# EasyEDA schematic SCH_tactile patches V5_2022-08-01.json

## Sheets
1 main copy copy copy: TITLE: main; REV: 5.0; Date: 2021-10-20; Sheet: 1/3; Drawn By: zjkharry & kmyao; Company: City University of Hong Kong
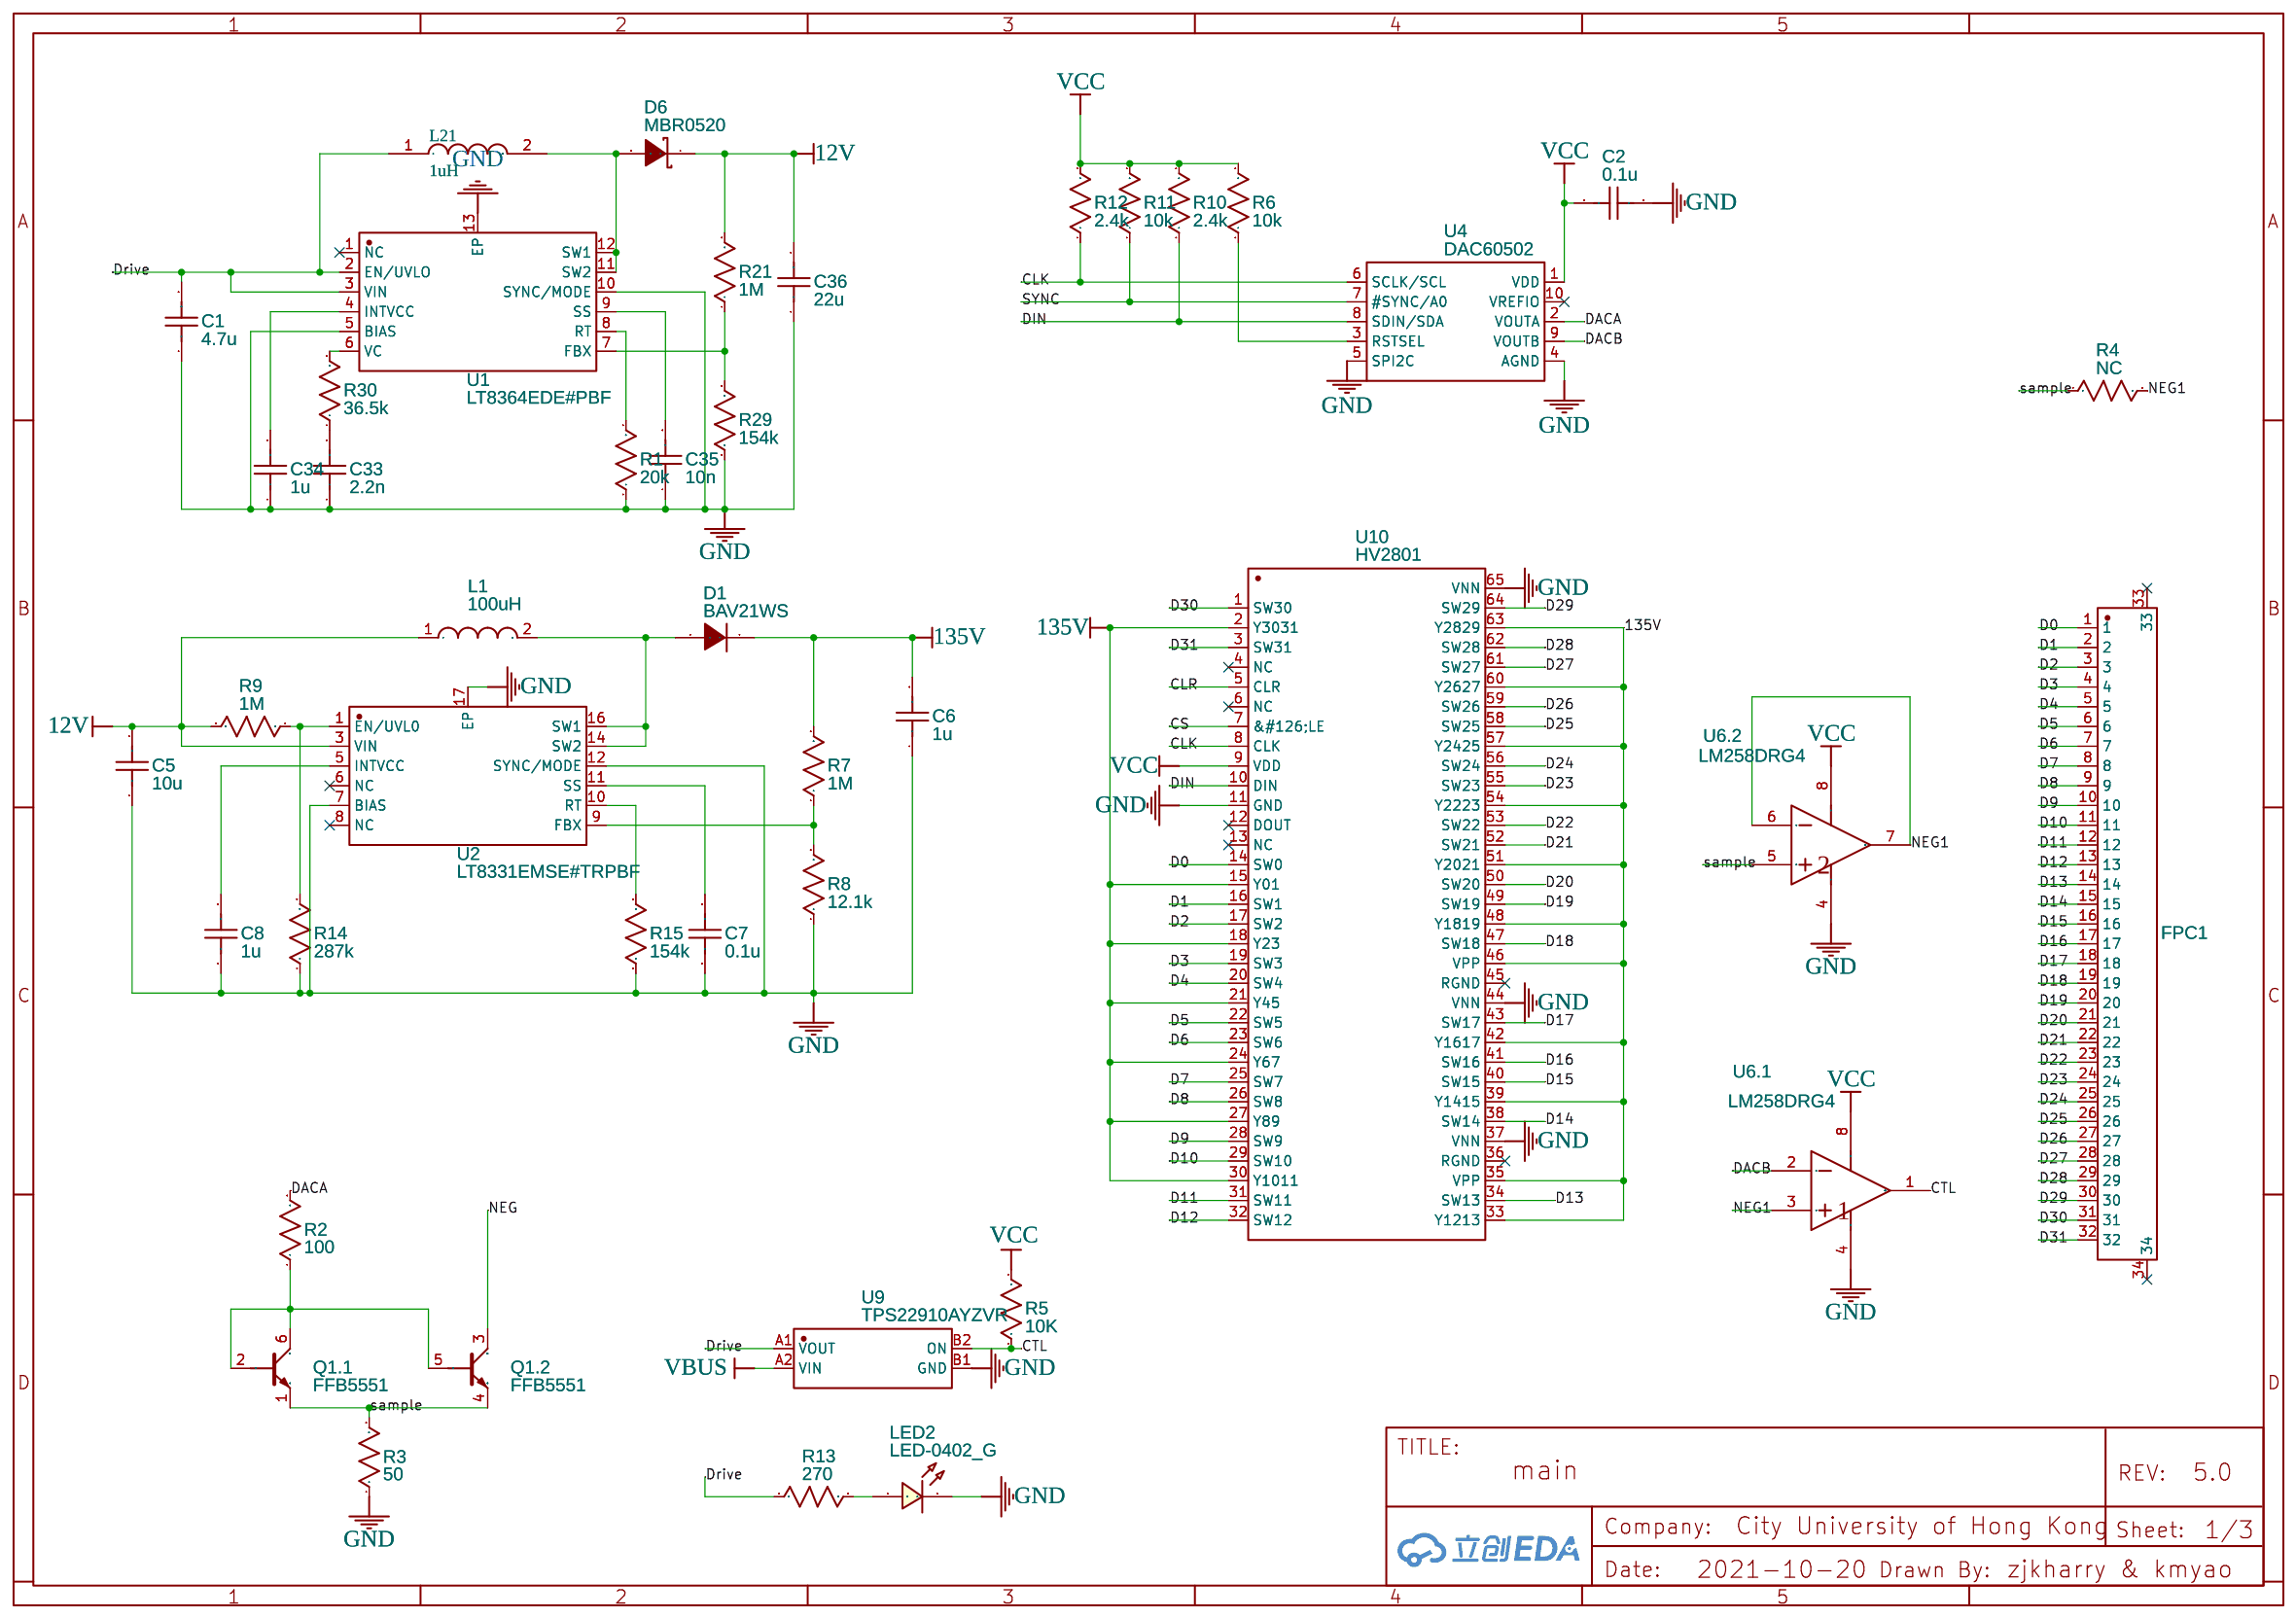
[diagram p0: main copy copy copy]
2 MCU copy copy copy: TITLE: MCU; REV: 1.0; Date: 2021-04-09; Sheet: 2/3
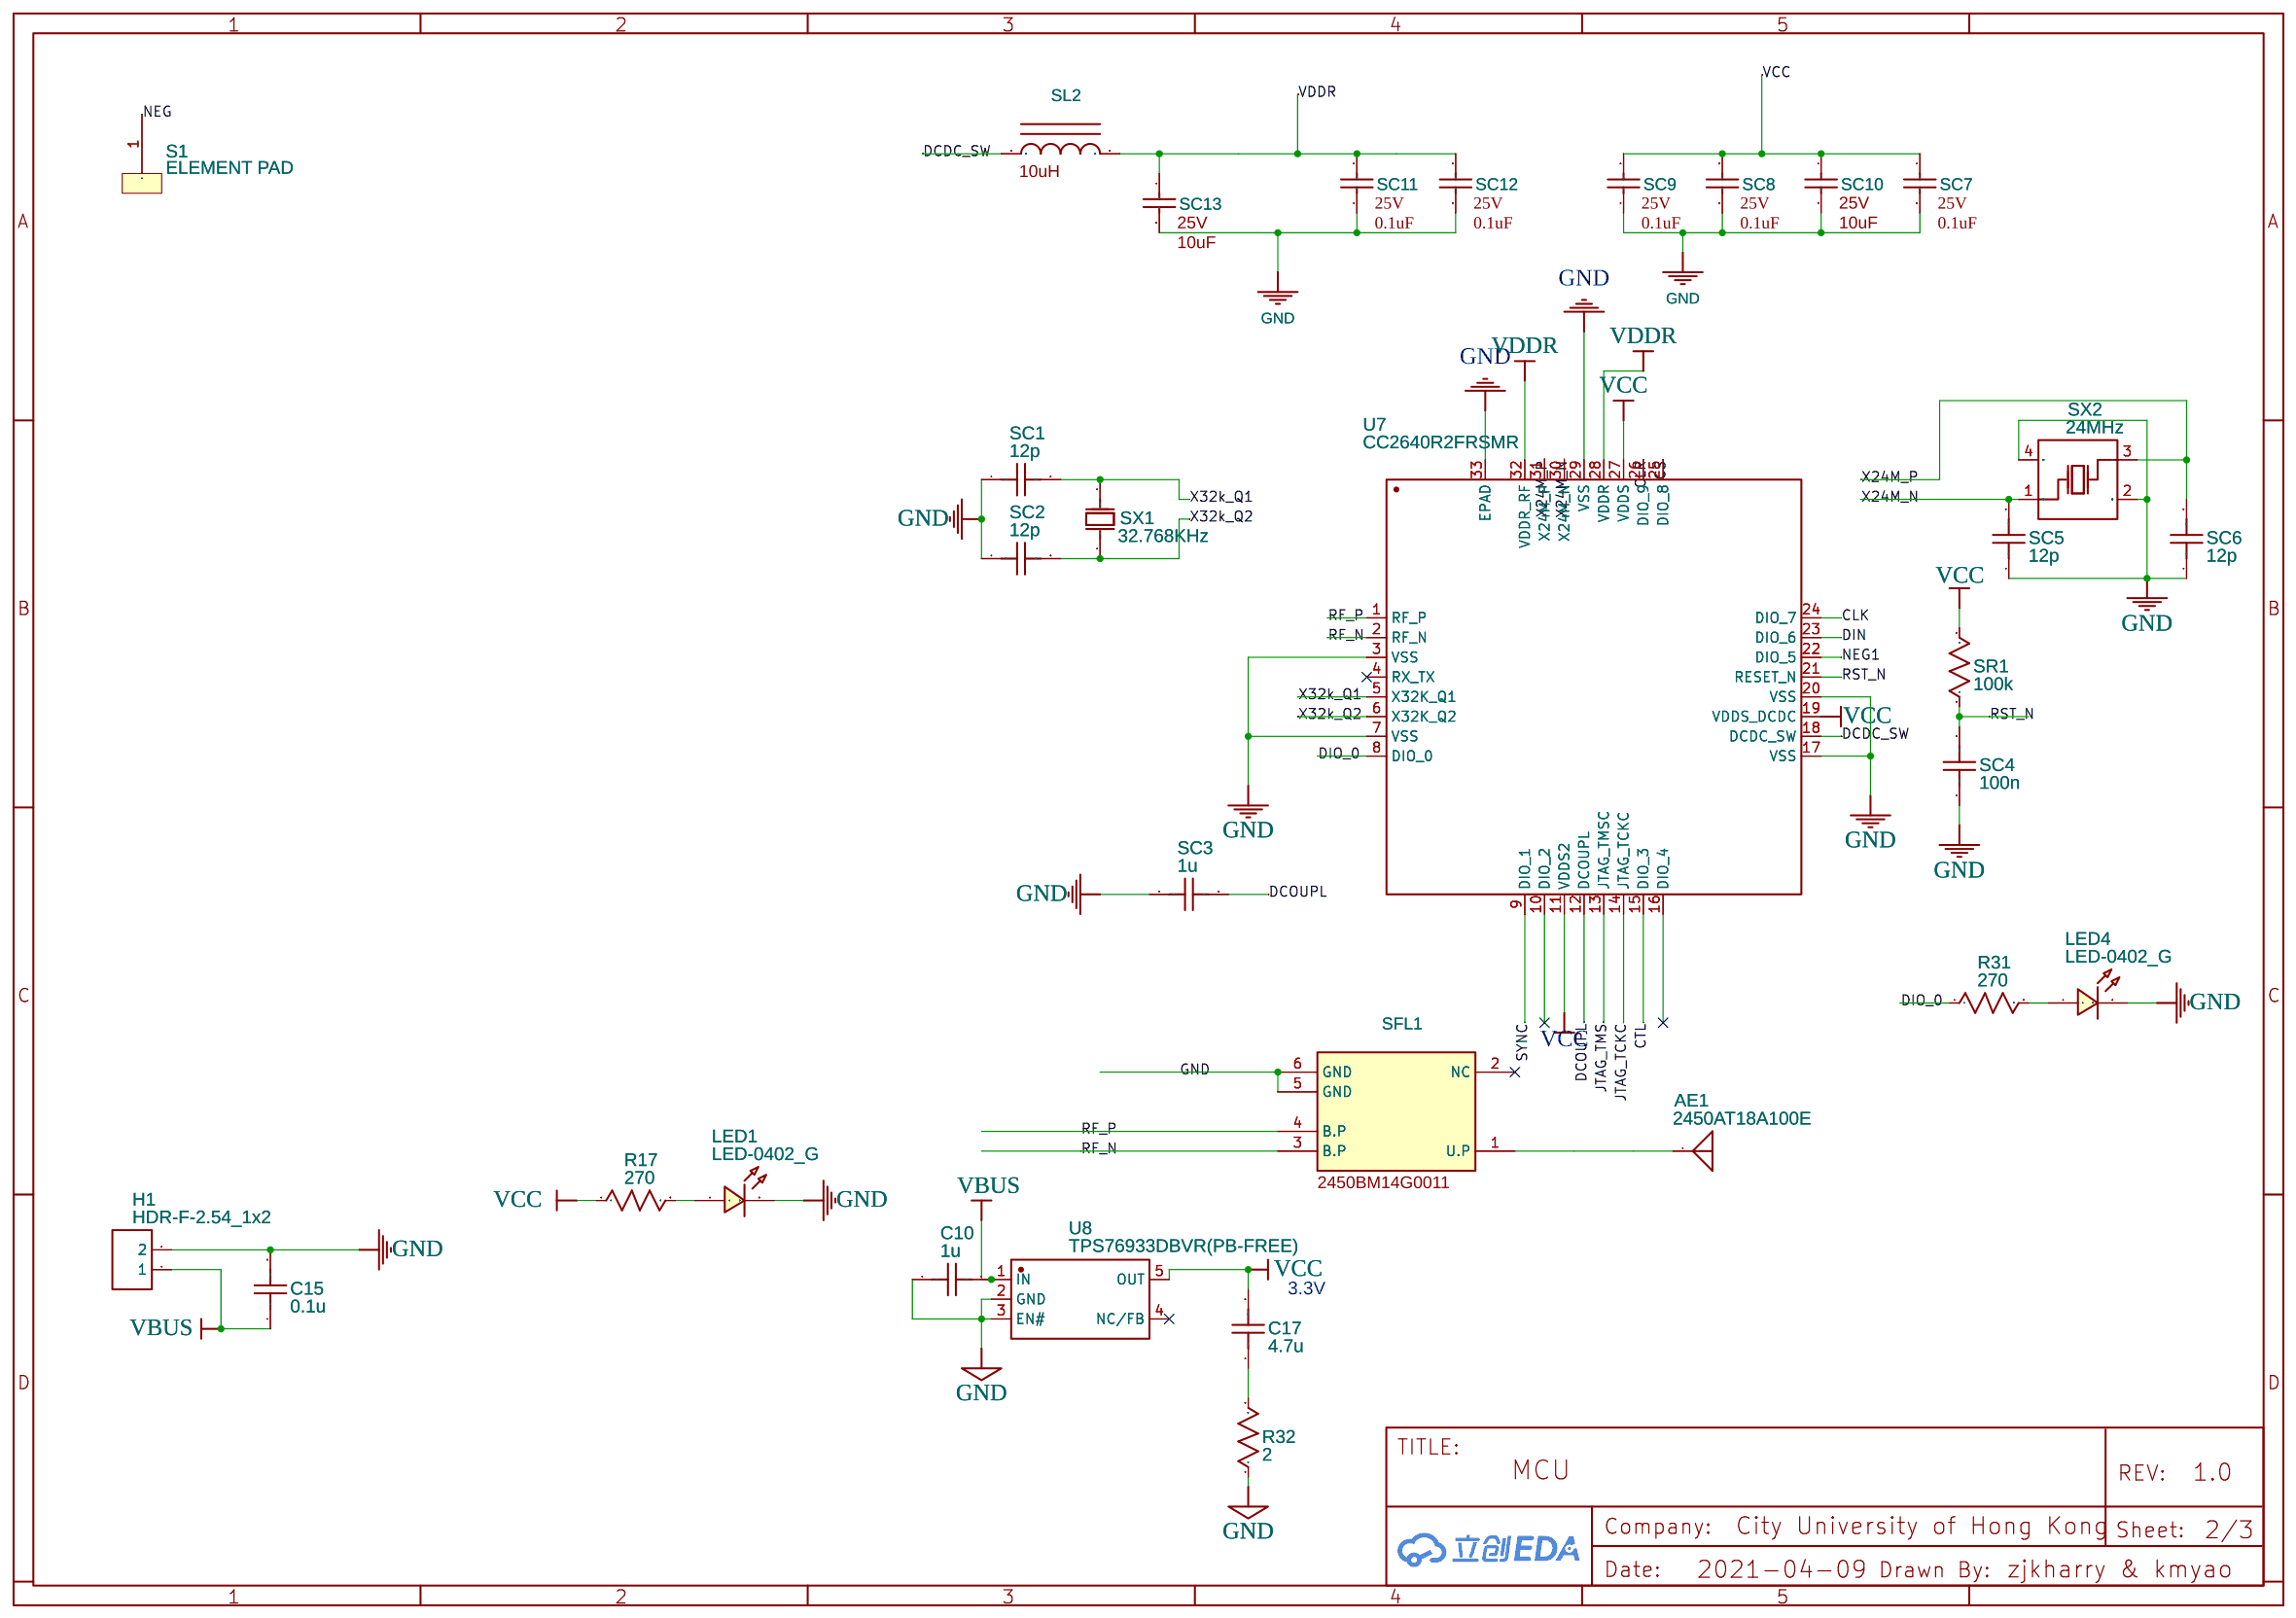
[diagram p1: MCU copy copy copy]
3 wireless charger: TITLE: wireless charger; REV: 1.0; Date: 2021-08-05; Sheet: 3/3
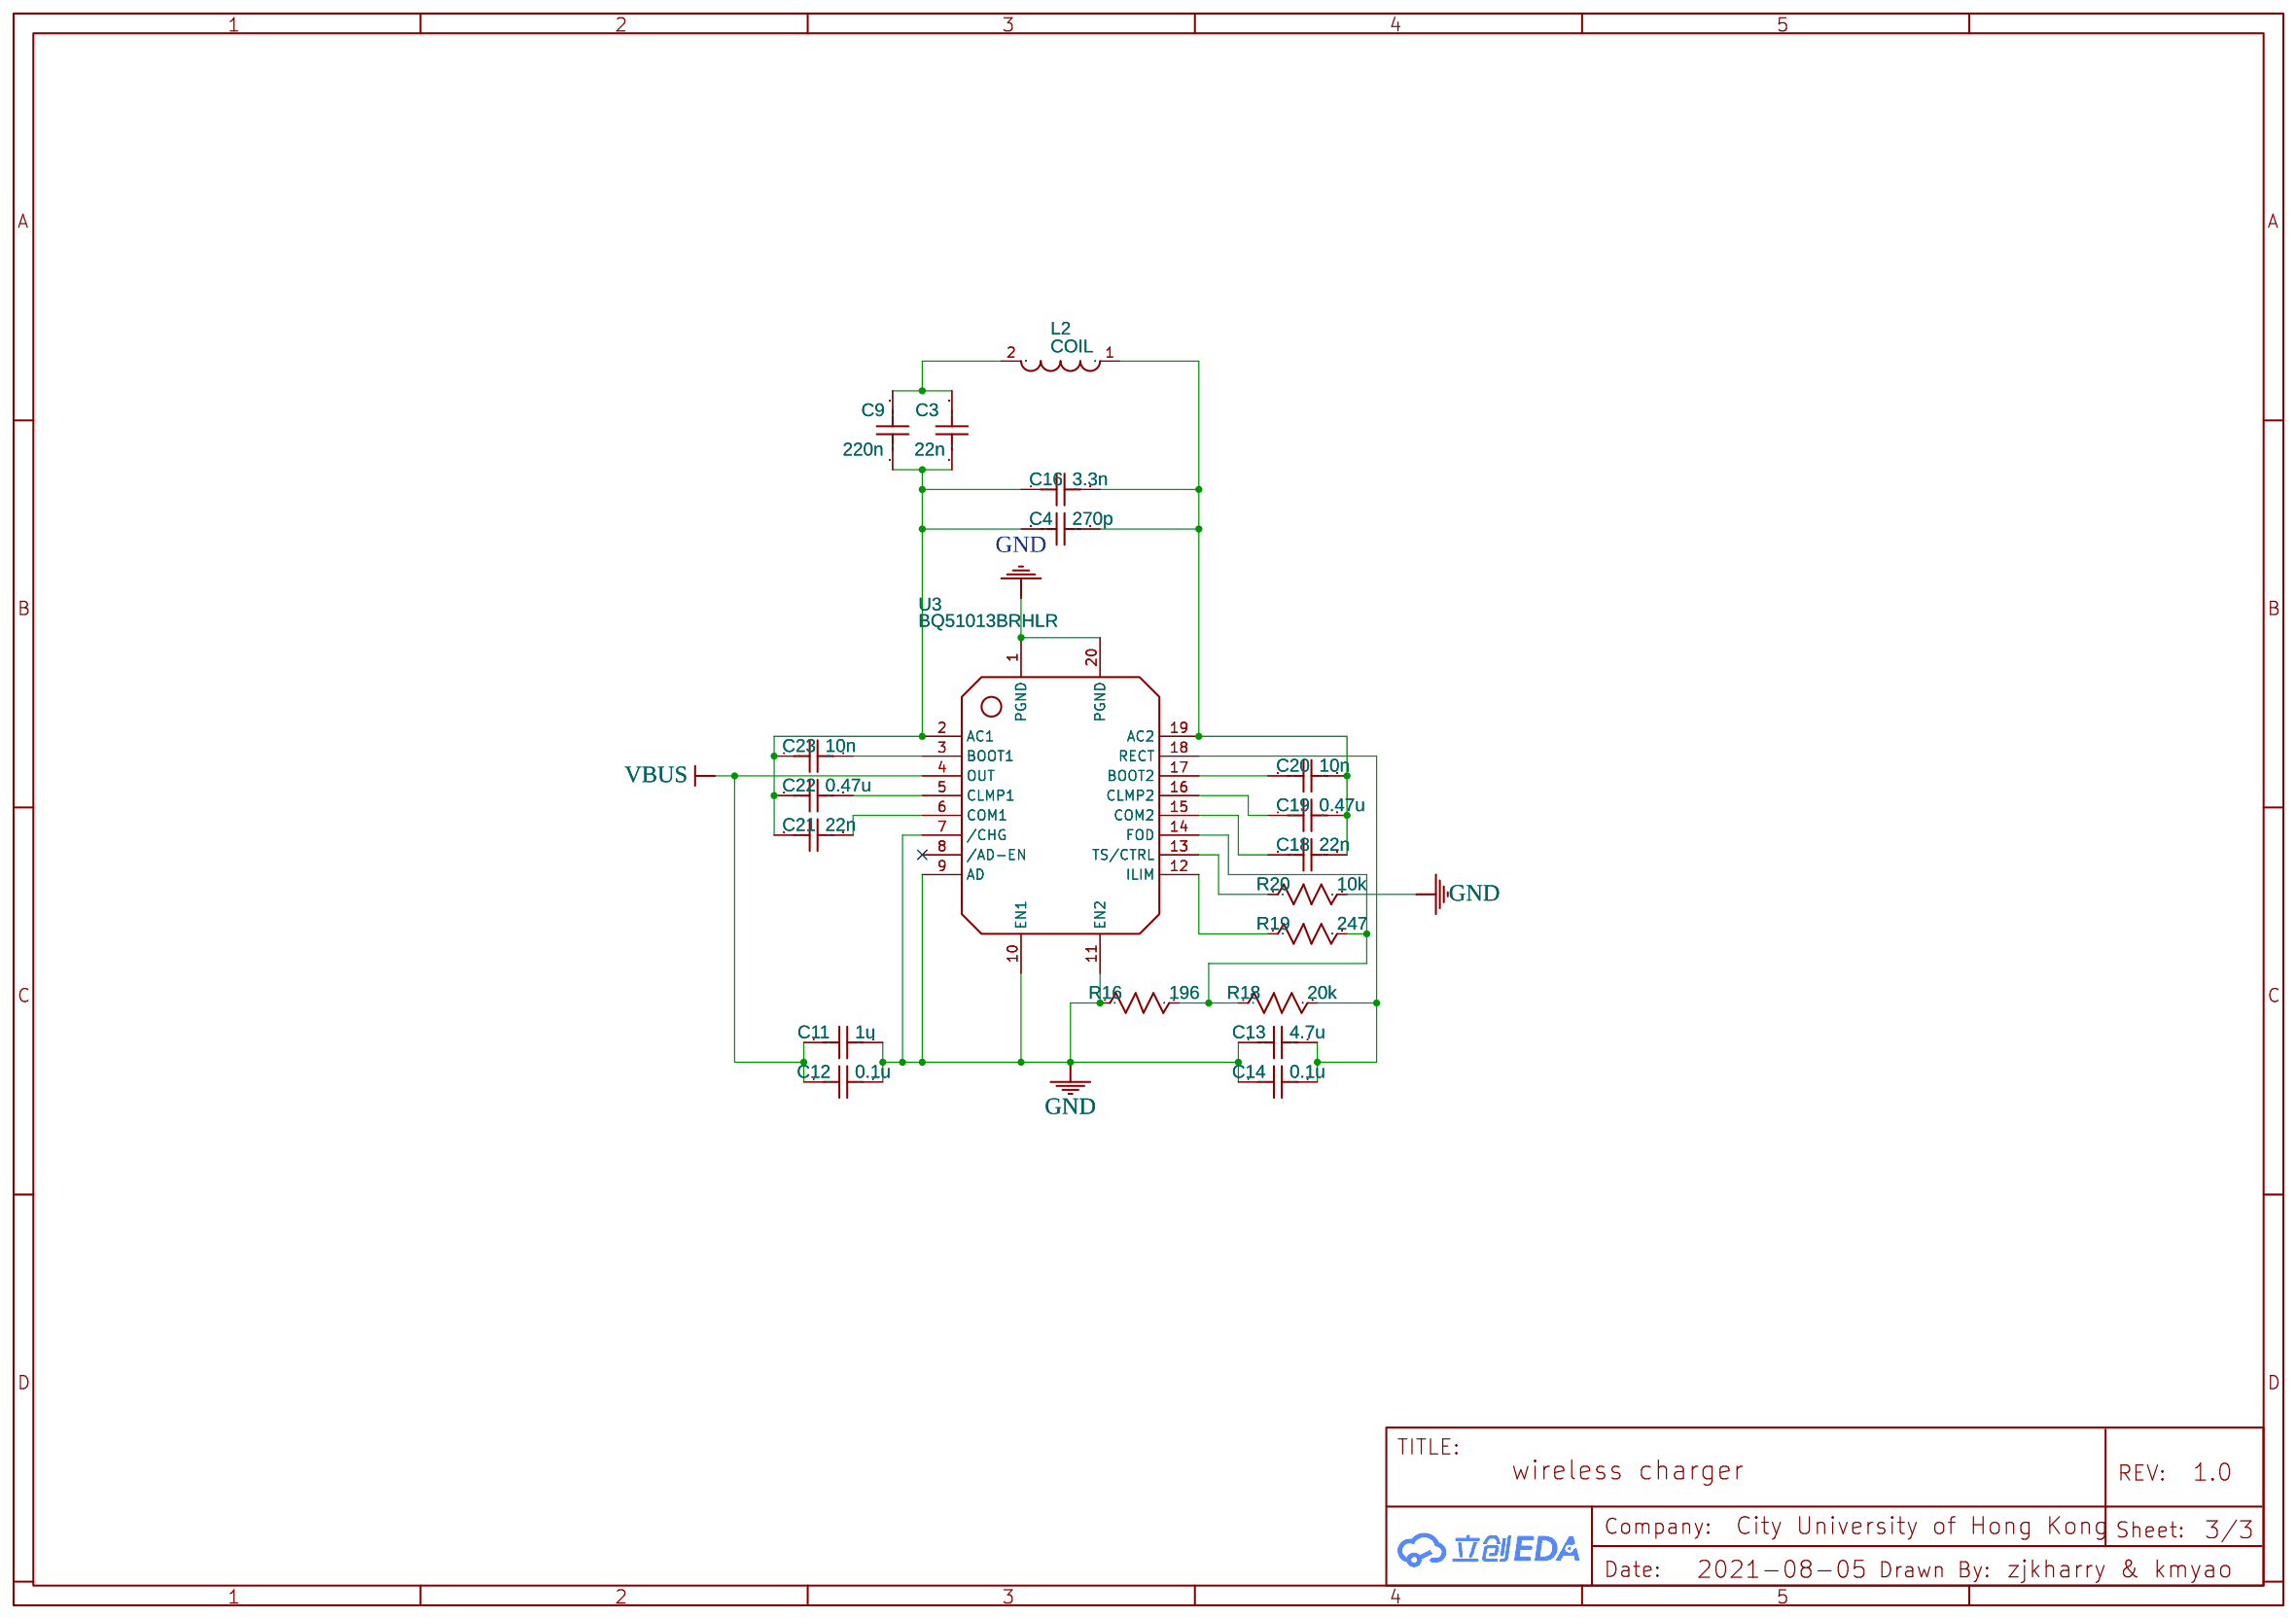
[diagram p2: wireless charger]

## Parts
sheet main copy copy copy
C1  4.7u  [C0402]
C2  0.1u  [C0402]
C5  10u  [C1210]
C6  1u  [C1812]
C7  0.1u  [C0402]
C8  1u  [C0402]
C33  2.2n  [C0402]
C34  1u  [C0402]
C35  10n  [C0402]
C36  22u  [C0402]
D1  BAV21WS  [SOD-323_L1.8-W1.3-LS2.5-RD]
D6  MBR0520  [SOD-123FL_L2.7-W1.8-LS3.8-RD]
FPC1  FPC 0.5MM 32P 翻盖式 H2.0  [FPC-SMD_FPC-0.5MM-32P]
L1  100uH  [L0805]
L21  1uH  [L0603]
LED2  LED-0402_G  [LED0402-R-RD]
Q1  FFB5551  [SOT-363_SC-70-6]  (sections 1,2)
R1  20k  [R0402]
R2  100  [R0402]
R3  50  [R0402]
R4  NC  [R0402]
R5  10K  [R0402]
R6  10k  [R0402]
R7  1M  [R0402]
R8  12.1k  [R0402]
R9  1M  [R0402]
R10  2.4k  [R0402]
R11  10k  [R0402]
R12  2.4k  [R0402]
R13  270  [R0402]
R14  287k  [R0402]
R15  154k  [R0402]
R21  1M  [R0402]
R29  154k  [R0402]
R30  36.5k  [R0402]
U1  LT8364EDE#PBF  [DFN-12_L4.0-W3.0-P0.50-BL-EP]
U2  LT8331EMSE#TRPBF  [MSOP-16_12P-L4.0-W3.0-P0.50-LS4.9-BL-EP]
U4  DAC60502  [DRX0010A]
U6  LM258DRG4  [SOIC-8_L5.0-W3.2-P1.27-LS8.3-BL]  (sections 1,2)
U9  TPS22910AYZVR  [DSBGA-4_L0.9-W0.9-R2-C2-P0.50-BL]
U10  HV2801  [QFN-64_L9.0-W9.0-P0.50-BL-EP7.2]
sheet MCU copy copy copy
AE1  2450AT18A100E  [ANT-SMD_L3.2-W1.6]
C10  1u  [C0402]
C15  0.1u  [C0402]
C17  4.7u  [C0402]
H1  HDR-F-2.54_1x2  [HDR-F-2.54_1X2]
LED1  LED-0402_G  [LED0402-R-RD]
LED4  LED-0402_G  [LED0402-R-RD]
R17  270  [R0402]
R31  270  [R0402]
R32  2  [R0402]
S1  ELEMENT PAD  [ELEMENT PAD]
SC1  12p  [C0402]
SC2  12p  [C0402]
SC3  1u  [C0402]
SC4  100n  [C0402]
SC5  12p  [C0402]
SC6  12p  [C0402]
SC7  0.1uF  [C0402]
SC8  0.1uF  [C0402]
SC9  0.1uF  [C0402]
SC10  10uF  [C0402]
SC11  0.1uF  [C0402]
SC12  0.1uF  [C0402]
SC13  10uF  [C0402]
SFL1  NO  [2450BM14G0011]
SL2  10uH  [L0603]
SR1  100k  [R0402]
SX1  32.768KHz  [OSC-SMD_L2.0-W1.2]
SX2  24MHz  [OSC-SMD_4P-L2.0-W1.6-BL]
U7  CC2640R2FRSMR  [VQFN-32_L4.0-W4.0-P0.40-TL-EP]
U8  TPS76933DBVR(PB-FREE)  [SOT-23-5_L3.0-W1.7-P0.95-LS2.8-BR]
sheet wireless charger
C3  22n  [C0402]
C4  270p  [C0402]
C9  220n  [C0402]
C11  1u  [C0402]
C12  0.1u  [C0402]
C13  4.7u  [C0402]
C14  0.1u  [C0402]
C16  3.3n  [C0402]
C18  22n  [C0402]
C19  0.47u  [C0402]
C20  10n  [C0402]
C21  22n  [C0402]
C22  0.47u  [C0402]
C23  10n  [C0402]
L2  COIL  [COIL_DUAL LAYER_30*40]
R16  196  [R0201]
R18  20k  [R0201]
R19  247  [R0201]
R20  10k  [R0201]
U3  BQ51013BRHLR  [QFN-20_L4.7-W3.7-P0.50-BL-EP]

## Library data of the parts
C1-C5 C7-C14 C16-C23 C33-C36 SC5 SC6 = C_0402_US: Contributor: LCEDA_Lib
C6 = C_1206_US: Contributor: LCEDA_Lib
D1 = BAV21WS: Supplier: LCSC; Manufacturer: CJ; Supplier Part: C22632; JLCPCB Part Class: Extended Part
D6 = MBR0540: Supplier: LCSC; Supplier Part: C116159; Manufacturer: SK; Contributor: LCSC; SMT Type: Extend; JLCPCB SMD: Yes
FPC1 = FPC 0.5MM 32P 翻盖式 H2.0: Supplier: LCSC; Supplier Part: C9353; Manufacturer: ATOM(爱特姆); Contributor: LCSC; JLCPCB Part Class: Extended Part
L1 = 744066101: SMD Shielded Tiny Power Inductor WE-TPC, L
L21 = -: Manufacturer_Name: Wurth Elektronik; Manufacturer_Part_Number: 74437349010
LED1 LED2 LED4 = LED-0603_G: Manufacturer: EVERLIGHT(台湾亿光); Manufacturer Part: 19-217/GHC-YR1S2/3T; Supplier Part: C72043; Supplier: LCSC; Contributor: LCEDA_Lib
Q1 = FFB5551: Contributor: L906006; subpart_no: 1
R1-R15 R17 R21 R29-R32 = R_0402_US: Contributor: LCEDA_Lib
U1 = LT8364EDE#PBF: Supplier: LCSC; Supplier Part: C673773; Manufacturer: Analog Devices; Contributor: LCSC
U2 = LT8331EMSE#TRPBF: Supplier: LCSC; Supplier Part: C673750; Manufacturer: Analog Devices; Contributor: LCSC
U4 = DAC60502: Manufacturer: Texas Instruments; Manufacturer Part: DAC60502DRXT; Supplier: Mouser; Supplier Part: 595-DAC60502DRXT; link: https://www.ti.com.cn/cn/lit/ds/symlink/dac60502.pdf?ts=1604838673803&ref_url=https%253A%252F%252Fwww.ti.com.cn%252Fproduct%252Fcn%252FDAC60502; Contributor: sam2020
U6 = LM258DRG4: Supplier: LCSC; Supplier Part: C350543; Manufacturer: Texas Instruments; subpart_no: 1; JLCPCB Part Class: Extended Part
U9 = TPS22910AYZVR: Supplier: LCSC; Supplier Part: C205966; Manufacturer: Texas Instruments; Contributor: LCSC
U10 = HV2801: Supplier: LCSC; Supplier Part: C430024; Manufacturer: SILICON LABS; Manufacturer Part: EFM32G840F64G-E-QFN64; Contributor: LCSC; JLCPCB Part Class: Extended Part
AE1 = 2450AT18A100E: Supplier: LCSC; Supplier Part: C89334; Manufacturer: Johanson Dielectrics; Contributor: LCSC
C15 = C_0603_US: Contributor: LCEDA_Lib
H1 = HDR-F-2.54_1x2: Supplier Part: C49661; Supplier: LCSC; Contributor: LCEDA_Lib
S1 = ELEMENT PAD: Contributor: zjkharry
SC1-SC4 = C_0201_US: Contributor: LCEDA_Lib
SC7-SC9 SC11 SC12 = -: TaMin_C: -55°C; Supplier Part Number 2: 31Y1751; Publisher: Texas Instruments; Supplier 2: Newark; Polarized: N; Supplier Part Number 3: 81-GRM155R71E104KE4D; TempCo: X7R; SizeAreaWB_mm2: 3; Supplier 3: Mouser; Published: 2008-06-19; RoHS: Y; Value1: Unknown; MountType: SMT; U/M: EA; TaMax_C: 125°C; Supplier 1: Digi-Key; Manufacturer: MuRata; PackageReference: 0402; Tolerance_%: 10%; SizeZ_mm: 0.6; SizeX_mm: 1; SizeY_mm: 0.5; Cap_Case: 0402; Value2: 25V; SizeArea_mm2: 0.5; CompType: Capacitor; LatestRevisionDate: 2017-03-09; PartNumber: GRM155R71E104KE14D; AEC Qualified: N; Cap_F: 100nF; VDC_V: 25V; ComponentLink1Description: Datasheet link; AEC Grade: N/A; Supplier Part Number 1: 490-10698-1-ND; AEC Category: Q200; Technology: Ceramic; ComponentLink1URL: http://search.murata.co.jp/Ceramy/image/img/A01X/G101/ENG/GRM155R71E104KE14-01.pdf; Comment: GRM155R71E104KE14D
SC10 SC13 = -: TaMin_C: -55°C; Publisher: Texas Instruments; Polarized: N; TempCo: X5R; SizeAreaWB_mm2: 4.68; Published: 2008-06-19; RoHS: Y; Value1: 0.004639 ohm; MountType: SMT; U/M: EA; TaMax_C: 85°C; Manufacturer: TDK; PackageReference: 0603; Tolerance_%: 20%; SizeZ_mm: 1; SizeX_mm: 1.6; SizeY_mm: 0.8; Cap_Case: 0603; Value2: 25V; SizeArea_mm2: 1.28; CompType: Capacitor; LatestRevisionDate: 2017-03-09; PartNumber: C1608X5R1E106M080AC; AEC Qualified: N; Cap_F: 10µF; VDC_V: 25V; ComponentLink1Description: Datasheet link; AEC Category: Q200; Technology: Ceramic; ComponentLink1URL: https://product.tdk.com/en/search/capacitor/ceramic/mlcc/info?part_no=C1608X5R1E106M080AC; AEC Grade: N/A; ESR_ohm: 4.639m; IRMS_A: 2.41407A; Supplier 1: Digi-Key; Supplier 2: Newark; Supplier 3: Mouser; Supplier Part Number 1: 445-9015-1-ND; Supplier Part Number 2: 07W9179; Supplier Part Number 3: 810-C1608X5R1E106M; Comment: C1608X5R1E106M080AC
SFL1 = -: SizeZ_mm: 0.7; SizeX_mm: 1.6; Publisher: Texas Instruments; LatestRevisionDate: 09/03/2017; PackageReference: 1.6x0.8mm; SizeY_mm: 0.8; SizeAreaWB_mm2: 4.68; MountType: SMT; RoHS: Y; ComponentLink1Description: Datasheet URL; CompType: Filter; SizeArea_mm2: 1.28; Manufacturer: Johanson Technology; ComponentLink1URL: http://www.johansontechnology.com/datasheets/baluns-matched/2450BM14G0011.pdf
SL2 = -: ComponentLink1URL: http://www.yuden.co.jp/ut/product/category/inductor/CKS2125100M-T.pdf; Publisher: Texas Instruments; Green_Lifecycle: Active; SizeAreaWB_mm2: 6.75; Published: 2008-06-26; DCR_ohm: 5.2d; Green_REACh: Passed; RoHS: Y; Value1: 0.52 ohm; Material: Ferrite; MountType: SMT; Green_EU RoHS-2: Passed; Supplier 1: Digi-Key; Manufacturer: Taiyo Yuden; Green_EU RoHS: Passed; PackageReference: 0805; Imax_A: 1.1dA; SizeZ_mm: 1.45; SizeX_mm: 2; SizeY_mm: 1.25; Value2: 0.11A; SizeArea_mm2: 2.5; CompType: Inductor; Ind_H: 10µH; LatestRevisionDate: 2017-06-02; PartNumber: CKS2125100M-T; AEC Qualified: ?; ComponentLink1Description: Datasheet link; Supplier Part Number 1: 587-2608-1-ND; AEC Category: Q200; Technology: Multilayer; Supplier 2: Newark; Supplier 3: Mouser; Supplier Part Number 2: 83T0110; Supplier Part Number 3: 963-CKS2125100M-T; Comment: CKS2125100M-T
R16 R18-R20 SR1 = R_0201_US: Contributor: LCEDA_Lib
SX1 = SC-20S32.768kHz20PPM9pF: Supplier: LCSC; Manufacturer: SEIKO; Supplier Part: C97603
SX2 = TAXM24M4ZCBCDT2T: Supplier: LCSC; Supplier Part: C424433; Manufacturer: TAE(Zhejiang Abel Elec); Contributor: LCSC
U7 = CC2640R2FRSMR: Supplier: LCSC; Manufacturer: TI; Voltage - Supply: 1.8V ~ 3.8V; Contributor: LCSC; Supplier Part: C133236
U8 = TPS76933DBVR(PB-FREE): Supplier: LCSC; Manufacturer: TI; image: //image.lceda.cn/szlcsc/C7101.jpg; Supplier Part: C7101; LCSC Assembly: Yes; SMT Type: Extend
L2 = WE-WPCC_1W(RECIVER)_桅10_760308101208: Wireless Power Charging Coil
U3 = BQ51013BRHLR: Supplier: LCSC; Manufacturer: TI; image: //image.lceda.cn/szlcsc/C55663.jpg; Supplier Part: C55663; SMT Type: Extend; JLCPCB SMD: Yes

## Nets
12V: C5.2 C36.2 D6.1(K) L1.1 R9.2 R21.2 U2.3(VIN)
135V: C6.2 D1.1(K) R7.2 U10.2(Y3031) U10.15(Y01) U10.18(Y23) U10.21(Y45) U10.24(Y67) U10.27(Y89) U10.30(Y1011) U10.33(Y1213) U10.35(VPP) U10.39(Y1415) U10.42(Y1617) U10.46(VPP) U10.48(Y1819) U10.51(Y2021) U10.54(Y2223) U10.57(Y2425) U10.60(Y2627) U10.63(Y2829)
GND: C1.1 C2.2 C5.1 C6.1 C7.1 C8.1 C10.1 C11.2 C12.2 C13.1 C14.1 C15.2 C33.1 C34.1 C35.1 C36.1 H1.2 LED1.2 LED2.2 LED4.2 R1.1 R3.1 R8.1 R14.1 R15.1 R16.1 R20.2 R29.1 R32.1 SC1.1 SC2.1 SC3.1 SC4.1 SC5.1 SC6.1 SC7.2 SC8.1 SC9.1 SC10.2 SC11.1 SC12.1 SC13.2 SFL1.5(GND) SFL1.6(GND) SX2.2(GND) SX2.4(GND) U1.5(BIAS) U1.10(SYNC/MODE) U1.13(EP) U2.7(BIAS) U2.12(SYNC/MODE) U2.17(EP) U3.1(PGND) U3.7(/CHG) U3.9(AD) U3.10(EN1) U3.11(EN2) U3.20(PGND) U4.4(AGND) U4.5(SPI2C) U6.4(V-) U7.3(VSS) U7.7(VSS) U7.17(VSS) U7.20(VSS) U7.29(VSS) U7.33(EPAD) U8.2(GND) U8.3(EN#) U9.B1(GND) U10.11(GND) U10.37(VNN) U10.44(VNN) U10.65(VNN)
VBUS: C10.2 C11.1 C12.1 C15.1 H1.1 U3.4(OUT) U8.1(IN) U9.A2(VIN)
VCC: C2.1 C17.2 R5.2 R6.2 R10.2 R11.2 R12.2 R17.1 SC7.1 SC8.2 SC9.2 SC10.1 SR1.2 U4.1(VDD) U6.8(V+) U7.11(VDDS2) U7.19(VDDS_DCDC) U7.27(VDDS) U8.5(OUT) U10.9(VDD)
VDDR: SC11.2 SC12.2 SC13.1 SL2.2 U7.28(VDDR) U7.32(VDDR_RF)
CLK: R12.1 U4.6(SCLK/SCL) U7.24(DIO_7) U10.8(CLK)
CLR: U7.26(DIO_9) U10.5(CLR)
CS: U7.25(DIO_8) U10.7(&#126;LE)
CTL: R5.1 U6.1(OUT) U7.15(DIO_3) U9.B2(ON)
D0: FPC1.1 U10.14(SW0)
D1: FPC1.2 U10.16(SW1)
D2: FPC1.3 U10.17(SW2)
D3: FPC1.4 U10.19(SW3)
D4: FPC1.5 U10.20(SW4)
D5: FPC1.6 U10.22(SW5)
D6: FPC1.7 U10.23(SW6)
D7: FPC1.8 U10.25(SW7)
D8: FPC1.9 U10.26(SW8)
D9: FPC1.10 U10.28(SW9)
D10: FPC1.11 U10.29(SW10)
D11: FPC1.12 U10.31(SW11)
D12: FPC1.13 U10.32(SW12)
D13: FPC1.14 U10.34(SW13)
D14: FPC1.15 U10.38(SW14)
D15: FPC1.16 U10.40(SW15)
D16: FPC1.17 U10.41(SW16)
D17: FPC1.18 U10.43(SW17)
D18: FPC1.19 U10.47(SW18)
D19: FPC1.20 U10.49(SW19)
D20: FPC1.21 U10.50(SW20)
D21: FPC1.22 U10.52(SW21)
D22: FPC1.23 U10.53(SW22)
D23: FPC1.24 U10.55(SW23)
D24: FPC1.25 U10.56(SW24)
D25: FPC1.26 U10.58(SW25)
D26: FPC1.27 U10.59(SW26)
D27: FPC1.28 U10.61(SW27)
D28: FPC1.29 U10.62(SW28)
D29: FPC1.30 U10.64(SW29)
D30: FPC1.31 U10.1(SW30)
D31: FPC1.32 U10.3(SW31)
DACA: R2.2 U4.2(VOUTA)
DACB: U4.9(VOUTB) U6.2(IN-)
DCDC_SW: SL2.1 U7.18(DCDC_SW)
DCOUPL: SC3.2 U7.12(DCOUPL)
DIN: R10.1 U4.8(SDIN/SDA) U7.23(DIO_6) U10.10(DIN)
DIO_0: R31.1 U7.8(DIO_0)
Drive: C1.2 L21.1 R13.1 U1.2(EN/UVLO) U1.3(VIN) U9.A1(VOUT)
JTAG_TCKC: U7.14(JTAG_TCKC)
JTAG_TMS: U7.13(JTAG_TMSC)
NEG: Q1.3(C2) S1.1
NEG1: R4.2 U6.3(IN+) U6.6(IN-) U6.7(OUT) U7.22(DIO_5)
RF_N: SFL1.3(B.P) U7.2(RF_N)
RF_P: SFL1.4(B.P) U7.1(RF_P)
RST_N: SC4.2 SR1.1 U7.21(RESET_N)
sample: Q1.1(E1) Q1.4(E2) R3.2 R4.1 U6.5(IN+)
SYNC: R11.1 U4.7(#SYNC/A0) U7.9(DIO_1)
X24M_N: SC5.2 SX2.1(OSC1) U7.30(X24M_N)
X24M_P: SC6.2 SX2.3(OSC2) U7.31(X24M_P)
X32k_Q1: SC1.2 SX1.2(OSC2) U7.5(X32K_Q1)
X32k_Q2: SC2.2 SX1.1(OSC1) U7.6(X32K_Q2)
Net-(AE1-1): AE1.1 SFL1.1(U.P)
Net-(C3-1): C3.1 C4.1 C9.1 C16.1 C21.1 C22.1 C23.1 U3.2(AC1)
Net-(C3-2): C3.2 C9.2 L2.2
Net-(C4-2): C4.2 C16.2 C18.2 C19.2 C20.2 L2.1 U3.19(AC2)
Net-(C7-2): C7.2 U2.11(SS)
Net-(C8-2): C8.2 U2.5(INTVCC)
Net-(C13-2): C13.2 C14.2 R18.2 U3.18(RECT)
Net-(C17-1): C17.1 R32.2
Net-(C18-1): C18.1 U3.15(COM2)
Net-(C19-1): C19.1 U3.16(CLMP2)
Net-(C20-1): C20.1 U3.17(BOOT2)
Net-(C21-2): C21.2 U3.6(COM1)
Net-(C22-2): C22.2 U3.5(CLMP1)
Net-(C23-2): C23.2 U3.3(BOOT1)
Net-(C33-2): C33.2 R30.1
Net-(C34-2): C34.2 U1.4(INTVCC)
Net-(C35-2): C35.2 U1.9(SS)
Net-(D1-2): D1.2(A) L1.2 U2.14(SW2) U2.16(SW1)
Net-(D6-2): D6.2(A) L21.2 U1.11(SW2) U1.12(SW1)
Net-(LED1-1): LED1.1 R17.2
Net-(LED2-1): LED2.1 R13.2
Net-(LED4-1): LED4.1 R31.2
Net-(Q1.1-2): Q1.2(B1) Q1.5(B2) Q1.6(C1) R2.1
Net-(R1-2): R1.2 U1.8(RT)
Net-(R6-1): R6.1 U4.3(RSTSEL)
Net-(R7-1): R7.1 R8.2 U2.9(FBX)
Net-(R9-1): R9.1 R14.2 U2.1(EN/UVL0)
Net-(R15-2): R15.2 U2.10(RT)
Net-(R16-2): R16.2 R18.1 R19.2 U3.14(FOD)
Net-(R19-1): R19.1 U3.12(ILIM)
Net-(R20-1): R20.1 U3.13(TS/CTRL)
Net-(R21-1): R21.1 R29.2 U1.7(FBX)
Net-(R30-2): R30.2 U1.6(VC)

Not connected (* = marked no-connect by the designer): FPC1 33* 34*; SFL1 2(NC)*; U1 1(NC)*; U2 6(NC)* 8(NC)*; U3 8(/AD-EN)*; U4 10(VREFIO)*; U7 4(RX_TX)* 10(DIO_2) 16(DIO_4); U8 4(NC/FB)*; U10 4(NC)* 6(NC)* 12(DOUT)* 13(NC)* 36(RGND)* 45(RGND)*

## Notes on the sheets
sheet 2
- 3.3V
